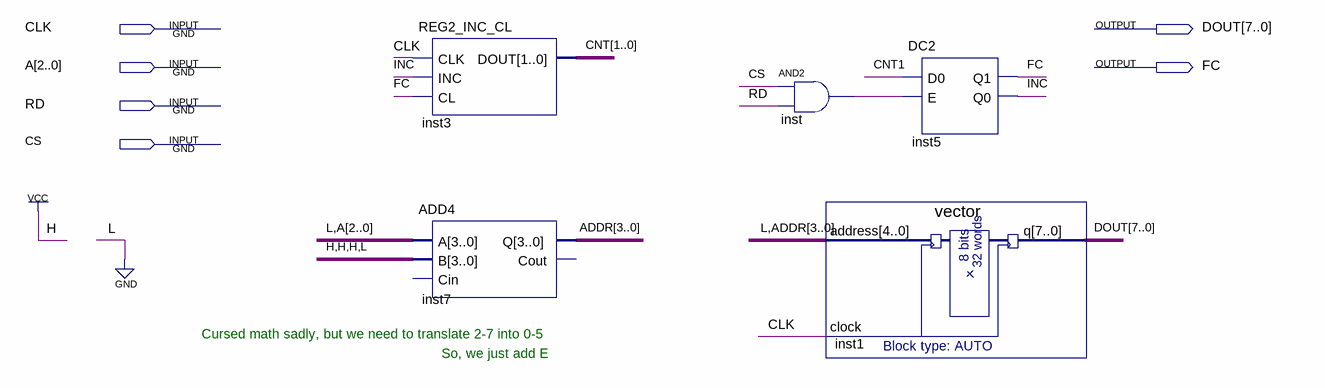
[diagram p0: schematic sheet]
// Quartus schematic vector_controller.bdf as structural Verilog: 5 symbols, 6 pins
module vector_controller (
  input  CLK,
  input  [2:0] A,
  input  RD,
  input  CS,
  output [7:0] DOUT,
  output FC
);

  wire INC, inst_out;
  wire [1:0] CNT;
  wire [3:0] ADDR;

  REG2_INC_CL inst3 (.CLK(CLK), .INC(INC), .CL(FC), .DOUT(CNT));
  ADD4 inst7 (.A({1'b0, A}), .B(4'b1110), .Q(ADDR));  // open: Cin, Cout
  and inst (inst_out, CS, RD);
  vector inst1 (.address({1'b0, ADDR}), .clock(CLK), .q(DOUT));
  DC2 inst5 (.D0(CNT[1]), .E(inst_out), .Q1(FC), .Q0(INC));

  // Notes on the sheet:
  //   Cursed math sadly, but we need to translate 2-7 into 0-5
  //   So, we just add E
endmodule
